# Altium schematic sheet SolBout.SchDoc
size A4; SheetNumber: 4; SheetTotal: 5
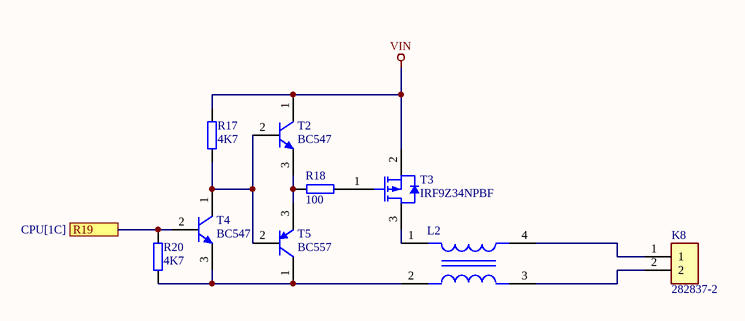
[diagram p0: SolBout.SchDoc]

## Parts
K8  282837-2  [TE_282837-2]
L2  (no value)  [2545]
R17  4K7  [CC_0805_m]
R18  100  [CC_0805_m]
R20  4K7  [CC_0805_m]
T2  BC547  [SOT_23]
T3  IRF9Z34NPBF  [TO_252]
T4  BC547  [SOT_23]
T5  BC557  [SOT_23]

## Ports
R19 (see CPU[1C])

## Nets
VIN: R17.2 T2.1(C) T3.2(SOURCE)
R19: R20.2 T4.2(B) ; port R19
NetK8_1: K8.1 L2.4
NetK8_2: K8.2 L2.3
NetL2_1: L2.1 T3.3(DRAIN)
NetL2_2: L2.2 R20.1 T4.3(E) T5.1(C)
NetR17_1: R17.1 T2.2(B) T4.1(C) T5.2(B)
NetR18_1: R18.1 T2.3(E) T5.3(E)
NetR18_2: R18.2 T3.1(GATE)

## Library data of the parts
K8 = 282837-2: Ð Ð°Ð·ÑŠÐµÐ¼Ð½Ñ‹Ðµ ÐºÐ»ÐµÐ¼Ð¼Ð½Ñ‹Ðµ ÐºÐ¾Ð»Ð¾Ð´ÐºÐ¸ Ð Ð¾Ð·ÐµÑ‚ÐºÐ° 2 Ð¿Ð¾Ð»Ð¾Ð¶ÐµÐ½Ð¸Ñ 5,08 Ð¼Ð¼ ÐŸÑ€Ð¸Ð¿Ð¾Ð¹ Ð¿Ñ€ÑÐ¼Ð¾Ð¹ Ñ‡ÐµÑ€ÐµÐ· Ð¾Ñ‚Ð²ÐµÑ€ÑÑ‚Ð¸Ðµ 13,5 Ð / ÐºÐ¾Ð½Ñ‚Ð°ÐºÑ‚; MF: TE Connectivity; SnapEDA_Link: https://www.snapeda.com/parts/282837-2/TE+Connectivity+AMP+Connectors/view-part/?ref=snap; Price: None; Check_prices: https://www.snapeda.com/parts/282837-2/TE+Connectivity+AMP+Connectors/view-part/?ref=eda; Purchase-URL: https://pricing.snapeda.com/search/part/282837-2/?ref=eda; MP: 282837-2; Value: *; Availability: In Stock; Package: None
L2 = Common_Mode_Choke: Max Current Rating: 2A; Number of Lines: 2; Impedance: 900R; Element Configuration: Dual; Insulation Resistance: 10MR; Test Frequency: 100MHz; DC Resistance (DCR): 60mR; Voltage Rating (DC): 50V; Current Rating: 2.3A; Number of Pins: 4; DC Current: 2A; Mount: Surface Mount; Current: 2A; REACH SVHC: No SVHC; Width: 4.5mm; Case/Package: 1808; Voltage Rating: 50V; Package Quantity: 1; Height: 2mm; Max DC Current: 2A; Packaging: Tape and Reel; Max Operating Temperature: 85°C; Lead Free: Lead Free; Length: 0.185inch; Series: ACM; Radiation Hardening: No; Max Voltage Rating (DC): 50V; Termination: Flat; Depth: 4.7mm; RoHS Compliant: Yes; DC Resistance-Max: 60mR; Min Operating Temperature: -40°C
R17 R18 R20 = Resistor: Manufacturer: Vishay Dale; Part Number: CRCW08050000Z0EA
T2 T4 = Transistor_NPN: Manufacturer: On Semiconductor; PartNumber: BC547C; IC Continuous (A): 0.1; fT Min (MHz): 150; Packing: Bulk Box; Polarity: NPN; Mounting Technology: Through Hole; ComponentLink1URL: http://www.onsemi.com/; ComponentLink1Description: Manufacturer URL; ComponentLink3URL: http://www.onsemi.cn/pub_link/Collateral/2N6426-D.PDF; DatasheetVersion: Rev. 7; PackageVersion: Rev. AM; RoHS: FALSE; ComponentLink2URL: http://www.onsemi.com/pub_link/Collateral/BC546-D.PDF; ComponentLink3Description: Package Specification; PackageDescription: 3-Pin Transistor Outline, Body 4.825 x 3.685 mm, Pitch 1.27 mm; PackageReference: TO-92-3-29-11_AM_SL; ComponentLink2Description: Datasheet
T3 = MOSFET_P: Manufacturer: Fairchild Semiconductor; Reel Quantity: 3000; Drain Source Voltage Vds: 20V; Power Dissipation Pd: 500mW; On Resistance Rds(on): 52mohm; Full Power Rating Temperature: 25°C; Voltage Vgs Max: -800mV; Pulse Current Idm: 10A; Rds(on) Test Voltage Vgs: -4.5V; External Depth: 2.5mm; Transistor Case Style: SOT-23; No. of Pins: 3; Continuous Drain Current Id: 2.4A; Voltage Vds Typ: -20V; Voltage Vgs th Max: -1.5V; Transistor Polarity: PChannel; Package Version: Rev. 3, 05/2015; External Width: 3.05mm; External Length / Height: 1.12mm; SMD Marking: 304P; SVHC: NoSVHC(19-Dec-2012); Termination Type: SMD; Datasheet URL: https://www.fairchildsemi.com/datasheets/FD/FDN304P.pdf; Tape Width: 8mm; Mounting Technology: SurfaceMount; Voltage Vgs Rds on Measurement: -4.5V; Operating Temperature Range: -55°Cto+150°C; Current Temperature: 25°C; Operating Temperature Min: -55°C; Threshold Voltage Vgs Typ: -800mV; Package / Case: SOT-23; Manufacturer URL: https://www.fairchildsemi.com/; Voltage Vds: 20V; Datasheet Version: Rev. C, 01/2001; Operating Temperature Max: 150°C; Package Description: 3-Pin Small Outline Transistor, Body 2.92 x 1.4 mm, Pitch 0.95 mm; Current Id Max: 2.4A; Package URL: https://www.fairchildsemi.com/package-drawings/MA/MA03B.pdf; Package Reference: SSOT3L
T5 = Transistor_PNP: Manufacturer: On Semiconductor; PartNumber: BC557C; Polarity: PNP; IC Continuous (A): -0.1; Packing: Bulk Box; PackageVersion: Rev. AM; RoHS: FALSE; PackageDescription: 3-Pin Transistor Outline, Body 4.825 x 3.685 mm, Pitch 1.27 mm; ComponentLink2Description: Datasheet; DatasheetVersion: Rev. 3; ComponentLink3Description: Package Specification; Mounting Technology: Through Hole; ComponentLink2URL: http://www.onsemi.com/pub_link/Collateral/BC556B-D.PDF; ComponentLink1URL: http://www.onsemi.com/; ComponentLink1Description: Manufacturer URL; ComponentLink3URL: http://www.onsemi.cn/pub_link/Collateral/2N6426-D.PDF; PackageReference: TO-92-3-29-11_AM_SL